# EasyEDA schematic SCH_Portable-PDS-DIMM-Card-Rev-1.1_2026-05-29.json
TITLE: Portable PDS DIMM Card Rev 1; REV: 1; Date: 2025-05-04; Sheet: 1/1; Drawn By: rezafouladian
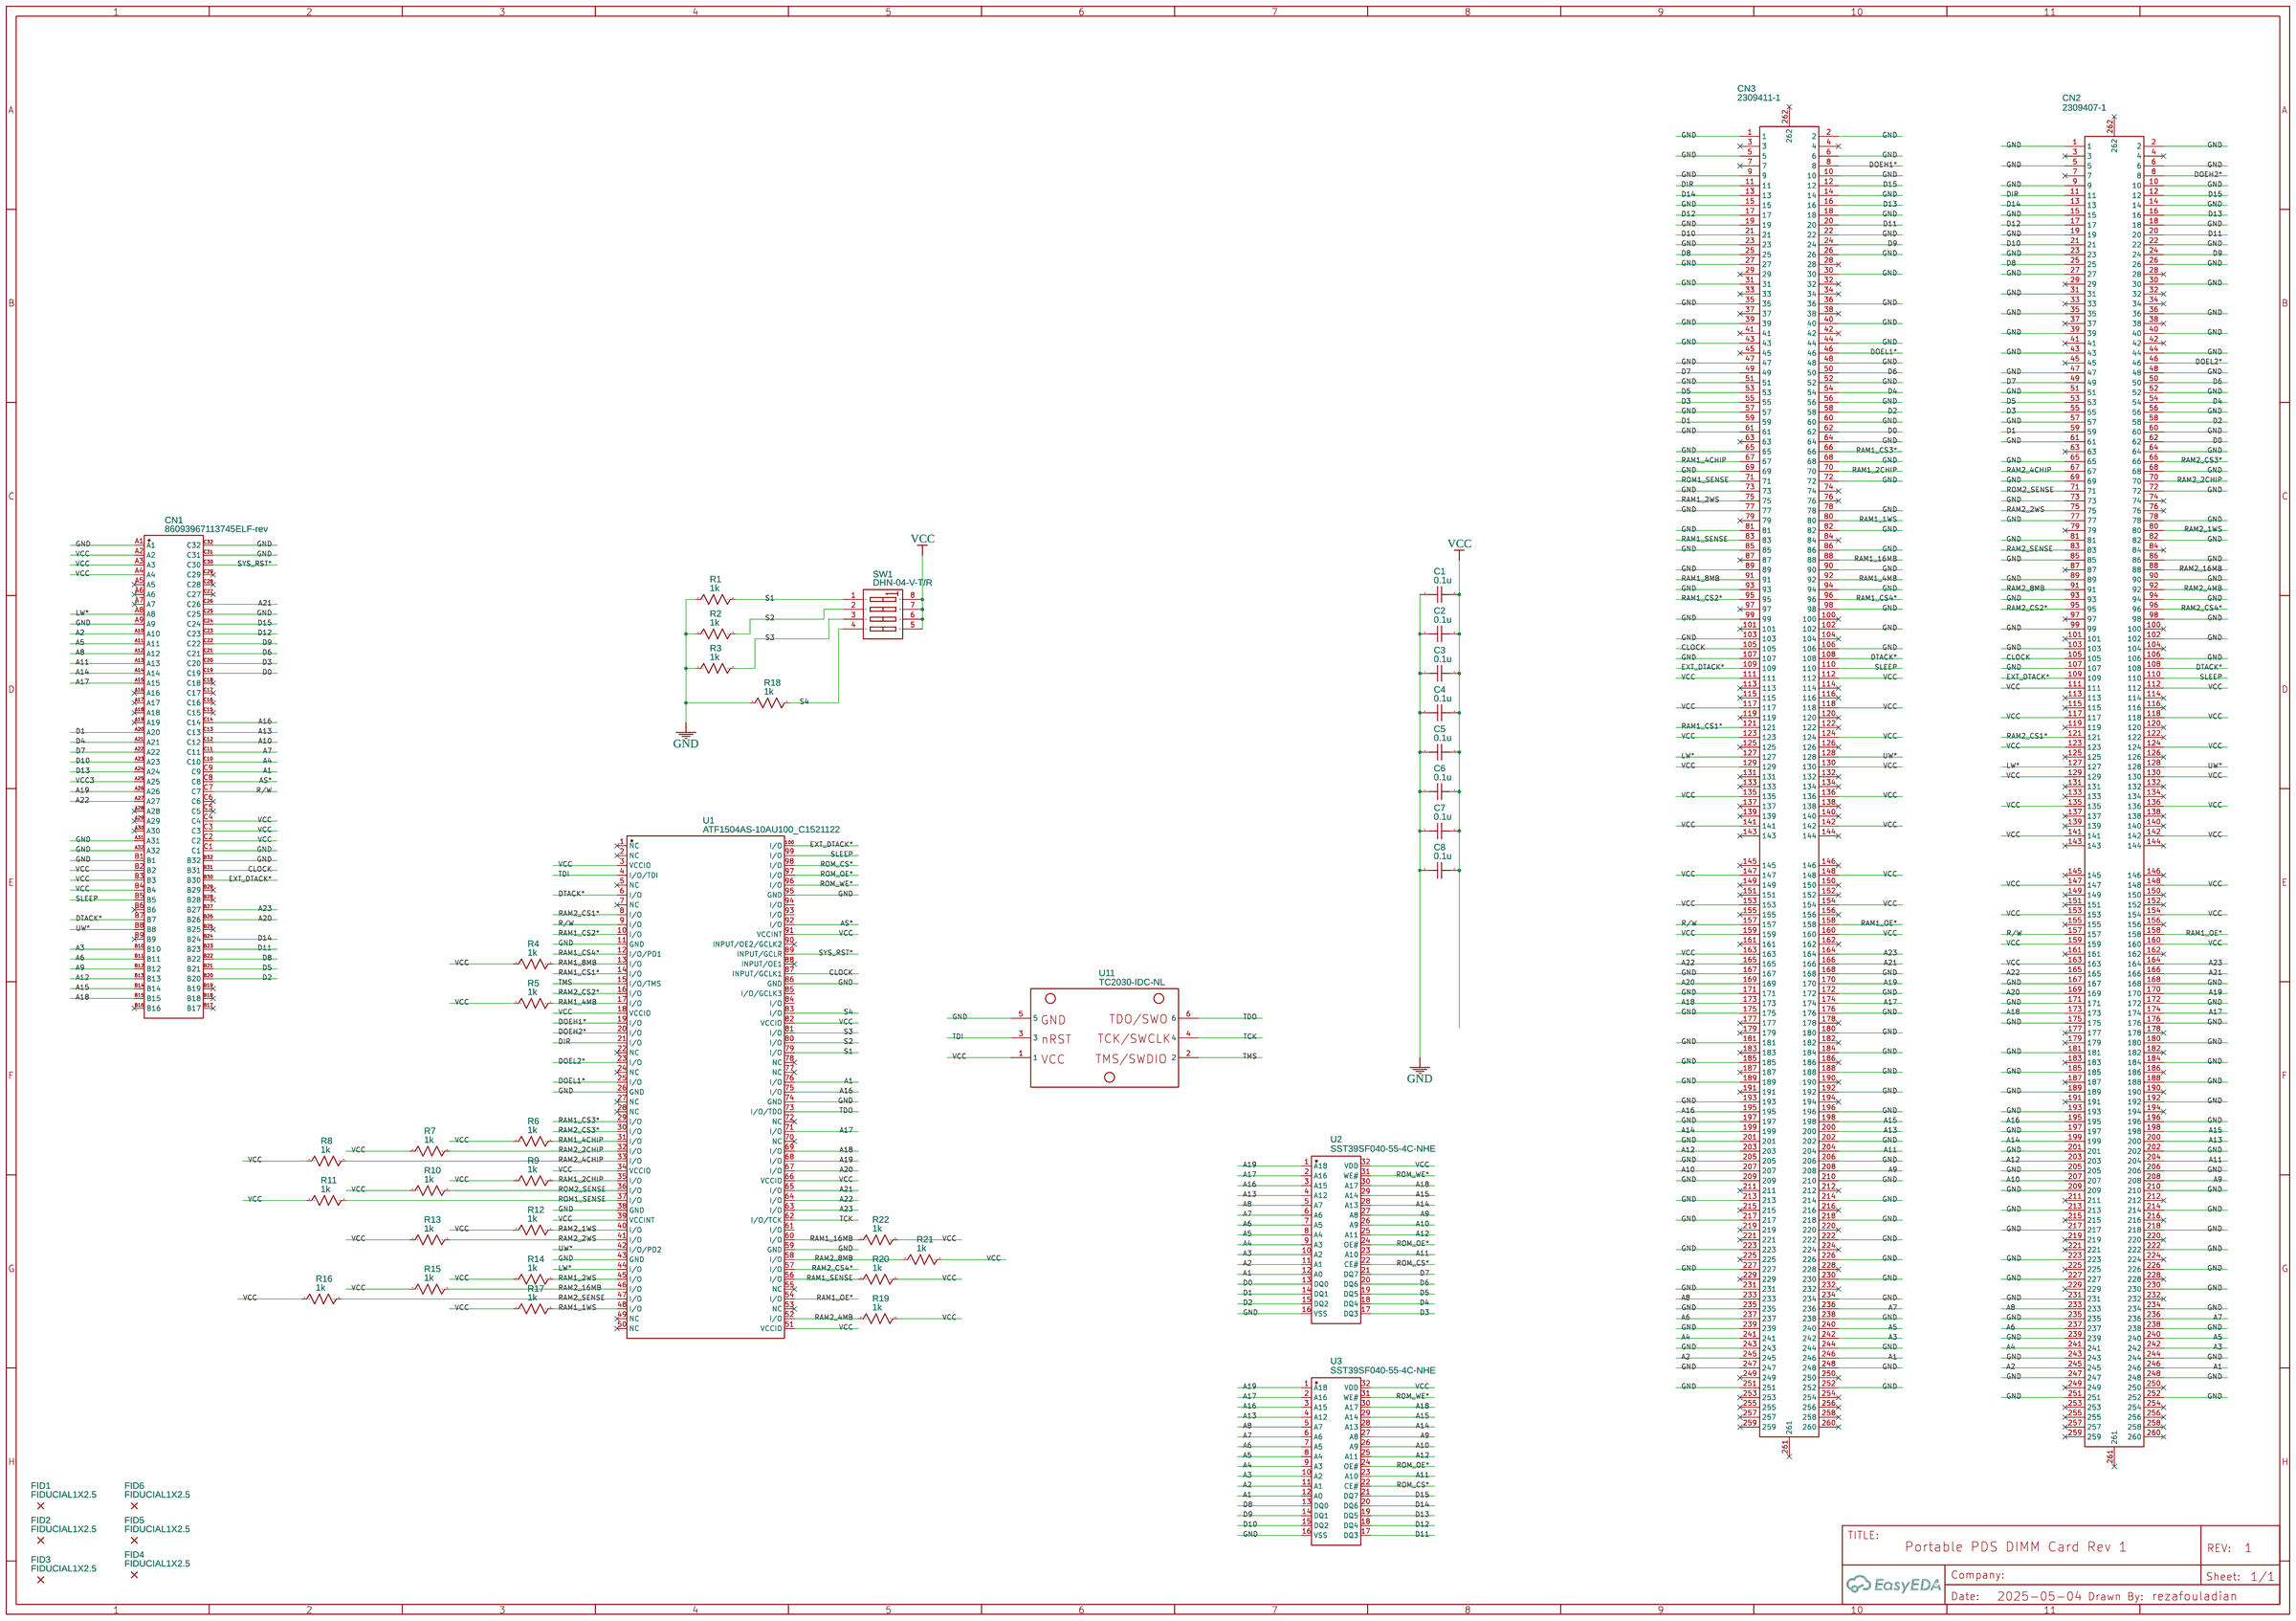
[diagram p0: schematic sheet]

## Parts
C1  0.1u  [C0402]
C2  0.1u  [C0402]
C3  0.1u  [C0402]
C4  0.1u  [C0402]
C5  0.1u  [C0402]
C6  0.1u  [C0402]
C7  0.1u  [C0402]
C8  0.1u  [C0402]
CN1  86093967113745ELF-rev  [IDC-TH_96P-P2.54_86093967113745ELF-REV]
CN2  2309407-1  [CONN-SMD_260P-P0.50_TE-CONNECTIVITY_2309407-1]
CN3  2309411-1  [CONN-SMD_260P-P0.50_2309411-3]
FID1  FIDUCIAL1X2.5  [FIDUCIAL-1X2.5]
FID2  FIDUCIAL1X2.5  [FIDUCIAL-1X2.5]
FID3  FIDUCIAL1X2.5  [FIDUCIAL-1X2.5]
FID4  FIDUCIAL1X2.5  [FIDUCIAL-1X2.5]
FID5  FIDUCIAL1X2.5  [FIDUCIAL-1X2.5]
FID6  FIDUCIAL1X2.5  [FIDUCIAL-1X2.5]
OSHW  OSHWA LOGO  [OSHWA LOGO]
R1  1k  [R0402]
R2  1k  [R0402]
R3  1k  [R0402]
R4  1k  [R0402]
R5  1k  [R0402]
R6  1k  [R0402]
R7  1k  [R0402]
R8  1k  [R0402]
R9  1k  [R0402]
R10  1k  [R0402]
R11  1k  [R0402]
R12  1k  [R0402]
R13  1k  [R0402]
R14  1k  [R0402]
R15  1k  [R0402]
R16  1k  [R0402]
R17  1k  [R0402]
R18  1k  [R0402]
R19  1k  [R0402]
R20  1k  [R0402]
R21  1k  [R0402]
R22  1k  [R0402]
SW1  DHN-04-V-T/R  [SW-TH_DHN-04-V-T-R]
U1  ATF1504AS-10AU100_C1521122  [TQFP-100_L14.0-W14.0-P0.50-LS16.0-BL]
U2  SST39SF040-55-4C-NHE  [PLCC-32_L14.0-W11.4-P1.27-LS15.0-T]
U3  SST39SF040-55-4C-NHE  [PLCC-32_L14.0-W11.4-P1.27-LS15.0-T]
U11  TC2030-IDC-NL  [TAG-CONNECT_TC2030-IDC-NL]

## Library data of the parts
C1-C8 = C_0402_US: Contributor: LCEDA_Lib
CN1 = 86093967113745ELF-rev: Contributor: rezafouladian; Supplier: LCSC; Supplier Part: C464654; Manufacturer: Amphenol; Manufacturer Part: 86093967113745ELF; JLCPCB Part Class: Extended Part
CN2 = 2309407-1: Contributor: LCSC; Supplier: LCSC; Supplier Part: C592559; Manufacturer: TE Connectivity(泰科电子); JLCPCB Part Class: Extended Part
CN3 = 2309411-1: Supplier: LCSC; Supplier Part: C5163334; Manufacturer: TE Connectivity(泰科电子); JLCPCB Part Class: Extended Part; Contributor: lcsc
FID1-FID6 = FIDUCIAL1X2.5: Contributor: rezafouladian
OSHW = OSHWA LOGO: Manufacturer: Open Source Hardware Association; Contributor: e.llull
R1-R22 = R_0402_US: Contributor: LCEDA_Lib
SW1 = DHN-04-V-T/R: Supplier: LCSC; Supplier Part: C224996; Manufacturer: 圜达; Contributor: LCSC; JLCPCB Part Class: Extended Part
U1 = ATF1504AS-10AU100_C1521122: Contributor: LCSC; Supplier: LCSC; Supplier Part: C1521122; Manufacturer: MICROCHIP(美国微芯); Manufacturer Part: ATF1504AS-10AU100; JLCPCB Part Class: Extended Part
U2 U3 = SST39SF040-55-4C-NHE: Contributor: lcsc; Supplier: LCSC; Supplier Part: C645935; Manufacturer: MICROCHIP(美国微芯); JLCPCB Part Class: Extended Part
U11 = TC2030-IDC-NL: Manufacturer: Tag-Connect; Supplier Part: TC2030-IDC; link: https://www.tag-connect.com/product/tc2030-idc-nl; Contributor: zhaomh1998

## Nets
GND: C1.1 C2.1 C3.1 C4.1 C5.1 C6.1 C7.1 C8.1 CN1.A1 CN1.A9 CN1.A31 CN1.A32 CN1.B1 CN1.B32 CN1.C1 CN1.C25 CN1.C31 CN1.C32 CN2.1 CN2.2 CN2.5 CN2.6 CN2.9 CN2.10 CN2.14 CN2.15 CN2.18 CN2.19 CN2.22 CN2.23 CN2.26 CN2.27 CN2.30 CN2.31 CN2.35 CN2.36 CN2.39 CN2.40 CN2.43 CN2.44 CN2.47 CN2.48 CN2.51 CN2.52 CN2.56 CN2.57 CN2.60 CN2.61 CN2.64 CN2.65 CN2.68 CN2.69 CN2.72 CN2.73 CN2.77 CN2.78 CN2.81 CN2.82 CN2.85 CN2.86 CN2.89 CN2.90 CN2.93 CN2.94 CN2.98 CN2.99 CN2.102 CN2.103 CN2.106 CN2.107 CN2.167 CN2.168 CN2.171 CN2.172 CN2.175 CN2.176 CN2.180 CN2.181 CN2.184 CN2.185 CN2.188 CN2.189 CN2.192 CN2.193 CN2.196 CN2.197 CN2.201 CN2.202 CN2.205 CN2.206 CN2.209 CN2.210 CN2.213 CN2.214 CN2.217 CN2.218 CN2.222 CN2.223 CN2.226 CN2.227 CN2.230 CN2.231 CN2.234 CN2.235 CN2.238 CN2.239 CN2.243 CN2.244 CN2.247 CN2.248 CN2.251 CN2.252 CN3.1 CN3.2 CN3.5 CN3.6 CN3.9 CN3.10 CN3.14 CN3.15 CN3.18 CN3.19 CN3.22 CN3.23 CN3.26 CN3.27 CN3.30 CN3.31 CN3.35 CN3.36 CN3.39 CN3.40 CN3.43 CN3.44 CN3.47 CN3.48 CN3.51 CN3.52 CN3.56 CN3.57 CN3.60 CN3.61 CN3.64 CN3.65 CN3.68 CN3.69 CN3.72 CN3.73 CN3.77 CN3.78 CN3.81 CN3.82 CN3.85 CN3.86 CN3.89 CN3.90 CN3.93 CN3.94 CN3.98 CN3.99 CN3.102 CN3.103 CN3.106 CN3.107 CN3.167 CN3.168 CN3.171 CN3.172 CN3.175 CN3.176 CN3.180 CN3.181 CN3.184 CN3.185 CN3.188 CN3.189 CN3.192 CN3.193 CN3.196 CN3.197 CN3.201 CN3.202 CN3.205 CN3.206 CN3.209 CN3.210 CN3.213 CN3.214 CN3.217 CN3.218 CN3.222 CN3.223 CN3.226 CN3.227 CN3.230 CN3.231 CN3.234 CN3.235 CN3.238 CN3.239 CN3.243 CN3.244 CN3.247 CN3.248 CN3.251 CN3.252 R1.1 R2.1 R3.1 R18.1 U1.11(GND) U1.26(GND) U1.38(GND) U1.43(GND) U1.59(GND) U1.74(GND) U1.86(GND) U1.95(GND) U2.16(VSS) U3.16(VSS) U11.5
VCC: C1.2 C2.2 C3.2 C4.2 C5.2 C6.2 C7.2 C8.2 CN1.A2 CN1.A3 CN1.A4 CN1.B2 CN1.B3 CN1.B4 CN1.C2 CN1.C3 CN1.C4 CN2.111 CN2.112 CN2.117 CN2.118 CN2.123 CN2.124 CN2.129 CN2.130 CN2.135 CN2.136 CN2.141 CN2.142 CN2.147 CN2.148 CN2.153 CN2.154 CN2.159 CN2.160 CN2.163 CN3.111 CN3.112 CN3.117 CN3.118 CN3.123 CN3.124 CN3.129 CN3.130 CN3.135 CN3.136 CN3.141 CN3.142 CN3.147 CN3.148 CN3.153 CN3.154 CN3.159 CN3.160 CN3.163 R4.1 R5.1 R6.1 R7.1 R8.1 R9.1 R10.1 R11.1 R12.1 R13.1 R14.1 R15.1 R16.1 R17.1 R19.2 R20.2 R21.2 R22.2 SW1.5(B4) SW1.6(B3) SW1.7(B2) SW1.8(B1) U1.3(VCCIO) U1.18(VCCIO) U1.34(VCCIO) U1.39(VCCINT) U1.51(VCCIO) U1.66(VCCIO) U1.82(VCCIO) U1.91(VCCINT) U2.32(VDD) U3.32(VDD) U11.1
VCC3: CN1.A25
A1: CN1.C9 CN2.246 CN3.246 U1.76(I/O) U2.12(A0) U3.12(A0)
A2: CN1.A10 CN2.245 CN3.245 U2.11(A1) U3.11(A1)
A3: CN1.B10 CN2.242 CN3.242 U2.10(A2) U3.10(A2)
A4: CN1.C10 CN2.241 CN3.241 U2.9(A3) U3.9(A3)
A5: CN1.A11 CN2.240 CN3.240 U2.8(A4) U3.8(A4)
A6: CN1.B11 CN2.237 CN3.237 U2.7(A5) U3.7(A5)
A7: CN1.C11 CN2.236 CN3.236 U2.6(A6) U3.6(A6)
A8: CN1.A12 CN2.233 CN3.233 U2.5(A7) U3.5(A7)
A9: CN1.B12 CN2.208 CN3.208 U2.27(A8) U3.27(A8)
A10: CN1.C12 CN2.207 CN3.207 U2.26(A9) U3.26(A9)
A11: CN1.A13 CN2.204 CN3.204 U2.23(A10) U3.23(A10)
A12: CN1.B13 CN2.203 CN3.203 U2.25(A11) U3.25(A11)
A13: CN1.C13 CN2.200 CN3.200 U2.4(A12) U3.4(A12)
A14: CN1.A14 CN2.199 CN3.199 U2.28(A13) U3.28(A13)
A15: CN1.B14 CN2.198 CN3.198 U2.29(A14) U3.29(A14)
A16: CN1.C14 CN2.195 CN3.195 U1.75(I/O) U2.3(A15) U3.3(A15)
A17: CN1.A15 CN2.174 CN3.174 U1.71(I/O) U2.2(A16) U3.2(A16)
A18: CN1.B15 CN2.173 CN3.173 U1.69(I/O) U2.30(A17) U3.30(A17)
A19: CN1.A26 CN2.170 CN3.170 U1.68(I/O) U2.1(A18) U3.1(A18)
A20: CN1.B26 CN2.169 CN3.169 U1.67(I/O)
A21: CN1.C26 CN2.166 CN3.166 U1.65(I/O)
A22: CN1.A27 CN2.165 CN3.165 U1.64(I/O)
A23: CN1.B27 CN2.164 CN3.164 U1.63(I/O)
AS*: CN1.C8 U1.92(I/O)
CLOCK: CN1.B31 CN2.105 CN3.105 U1.87(INPUT/GCLK1)
D0: CN1.C19 CN2.62 CN3.62 U2.13(DQ0)
D1: CN1.A20 CN2.59 CN3.59 U2.14(DQ1)
D2: CN1.B20 CN2.58 CN3.58 U2.15(DQ2)
D3: CN1.C20 CN2.55 CN3.55 U2.17(DQ3)
D4: CN1.A21 CN2.54 CN3.54 U2.18(DQ4)
D5: CN1.B21 CN2.53 CN3.53 U2.19(DQ5)
D6: CN1.C21 CN2.50 CN3.50 U2.20(DQ6)
D7: CN1.A22 CN2.49 CN3.49 U2.21(DQ7)
D8: CN1.B22 CN2.25 CN3.25 U3.13(DQ0)
D9: CN1.C22 CN2.24 CN3.24 U3.14(DQ1)
D10: CN1.A23 CN2.21 CN3.21 U3.15(DQ2)
D11: CN1.B23 CN2.20 CN3.20 U3.17(DQ3)
D12: CN1.C23 CN2.17 CN3.17 U3.18(DQ4)
D13: CN1.A24 CN2.16 CN3.16 U3.19(DQ5)
D14: CN1.B24 CN2.13 CN3.13 U3.20(DQ6)
D15: CN1.C24 CN2.12 CN3.12 U3.21(DQ7)
DIR: CN2.11 CN3.11 U1.21(I/O)
DOEH1*: CN3.8 U1.19(I/O)
DOEH2*: CN2.8 U1.20(I/O)
DOEL1*: CN3.46 U1.25(I/O)
DOEL2*: CN2.46 U1.23(I/O)
DTACK*: CN1.B7 CN2.108 CN3.108 U1.6(I/O)
EXT_DTACK*: CN1.B30 CN2.109 CN3.109 U1.100(I/O)
LW*: CN1.A8 CN2.127 CN3.127 U1.44(I/O)
R/W: CN1.C7 CN2.157 CN3.157 U1.9(I/O)
RAM1_1WS: CN3.80 R17.2 U1.48(I/O)
RAM1_2CHIP: CN3.70 R9.2 U1.35(I/O)
RAM1_2WS: CN3.75 R14.2 U1.45(I/O)
RAM1_4CHIP: CN3.67 R6.2 U1.31(I/O)
RAM1_4MB: CN3.92 R5.2 U1.17(I/O)
RAM1_8MB: CN3.91 R4.2 U1.13(I/O)
RAM1_16MB: CN3.88 R22.1 U1.60(I/O)
RAM1_CS1*: CN3.121 U1.14(I/O)
RAM1_CS2*: CN3.95 U1.10(I/O)
RAM1_CS3*: CN3.66 U1.29(I/O)
RAM1_CS4*: CN3.96 U1.12(I/O/PD1)
RAM1_OE*: CN2.158 CN3.158 U1.54(I/O)
RAM1_SENSE: CN3.83 R20.1 U1.56(I/O)
RAM2_1WS: CN2.80 R12.2 U1.40(I/O)
RAM2_2CHIP: CN2.70 R7.2 U1.32(I/O)
RAM2_2WS: CN2.75 R13.2 U1.41(I/O)
RAM2_4CHIP: CN2.67 R8.2 U1.33(I/O)
RAM2_4MB: CN2.92 R19.1 U1.52(I/O)
RAM2_8MB: CN2.91 R21.1 U1.58(I/O)
RAM2_16MB: CN2.88 R15.2 U1.46(I/O)
RAM2_CS1*: CN2.121 U1.8(I/O)
RAM2_CS2*: CN2.95 U1.16(I/O)
RAM2_CS3*: CN2.66 U1.30(I/O)
RAM2_CS4*: CN2.96 U1.57(I/O)
RAM2_SENSE: CN2.83 R16.2 U1.47(I/O)
ROM1_SENSE: CN3.71 R11.2 U1.37(I/O)
ROM2_SENSE: CN2.71 R10.2 U1.36(I/O)
ROM_CS*: U1.98(I/O) U2.22(CE#) U3.22(CE#)
ROM_OE*: U1.97(I/O) U2.24(OE#) U3.24(OE#)
ROM_WE*: U1.96(I/O) U2.31(WE#) U3.31(WE#)
S1: R1.2 SW1.1(A1) U1.79(I/O)
S2: R2.2 SW1.2(A2) U1.80(I/O)
S3: R3.2 SW1.3(A3) U1.81(I/O)
S4: R18.2 SW1.4(A4) U1.83(I/O)
SLEEP: CN1.B5 CN2.110 CN3.110 U1.99(I/O)
SYS_RST*: CN1.C30 U1.89(INPUT/GCLR)
TCK: U1.62(I/O/TCK) U11.4
TDI: U1.4(I/O/TDI) U11.3
TDO: U1.73(I/O/TDO) U11.6
TMS: U1.15(I/O/TMS) U11.2
UW*: CN1.B8 CN2.128 CN3.128 U1.42(I/O/PD2)

Not connected (* = marked no-connect by the designer): CN1 A5* A6* A7* A16* A17* A18* A19* A28* A29* A30* B6* B9* B16* B17* B18* B19* B25* B28* B29* C5* C6* C15* C16* C17* C18* C27* C28* C29*; CN2 3* 4* 7* 28* 29* 32* 33* 34* 37* 38* 41* 42* 45* 63* 74* 76* 79* 84* 87* 97* 100* 101* 104* 113* 114* 115* 116* 119* 120* 122* 125* 126* 131* 132* 133* 134* 137* 138* 139* 140* 143* 144* 145* 146* 149* 150* 151* 152* 155* 156* 161* 162* 177* 178* 179* 182* 183* 186* 187* 190* 191* 194* 211* 212* 215* 216* 219* 220* 221* 224* 225* 228* 229* 232* 249* 250* 253* 254* 255* 256* 257* 258* 259* 260* 261* 262*; CN3 3* 4* 7* 28* 29* 32* 33* 34* 37* 38* 41* 42* 45* 63* 74* 76* 79* 84* 87* 97* 100* 101* 104* 113* 114* 115* 116* 119* 120* 122* 125* 126* 131* 132* 133* 134* 137* 138* 139* 140* 143* 144* 145* 146* 149* 150* 151* 152* 155* 156* 161* 162* 177* 178* 179* 182* 183* 186* 187* 190* 191* 194* 211* 212* 215* 216* 219* 220* 221* 224* 225* 228* 229* 232* 249* 250* 253* 254* 255* 256* 257* 258* 259* 260* 261* 262*; U1 1(NC)* 2(NC)* 5(NC)* 7(NC)* 22(NC)* 24(NC)* 27(NC)* 28(NC)* 49(NC)* 50(NC)* 53(NC)* 55(NC)* 61(I/O) 70(NC)* 72(NC)* 77(NC)* 78(NC)* 84(I/O) 85(I/O/GCLK3) 88(INPUT/OE1)* 90(INPUT/OE2/GCLK2)* 93(I/O) 94(I/O)
